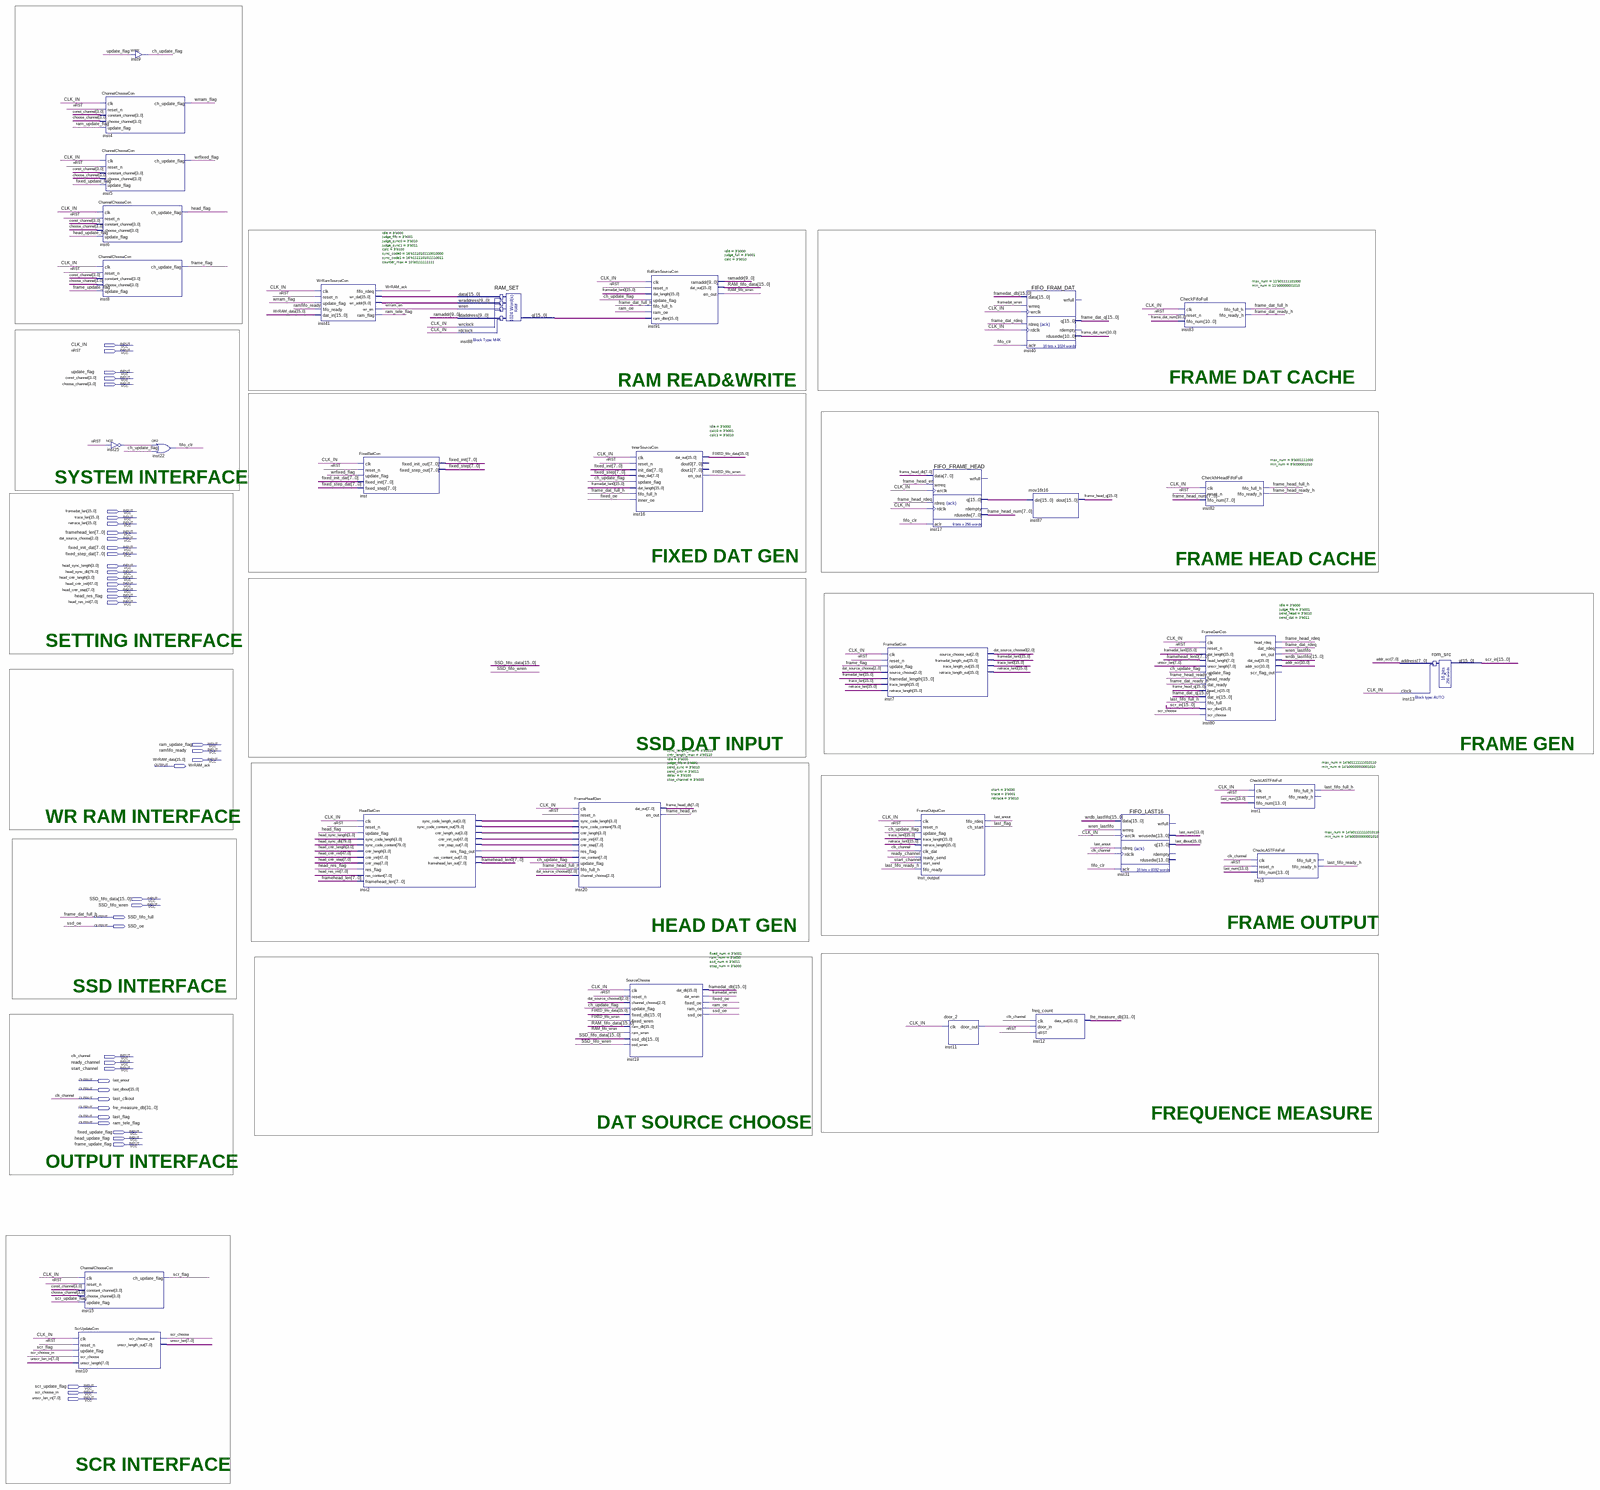
[diagram p0: schematic sheet, whole]
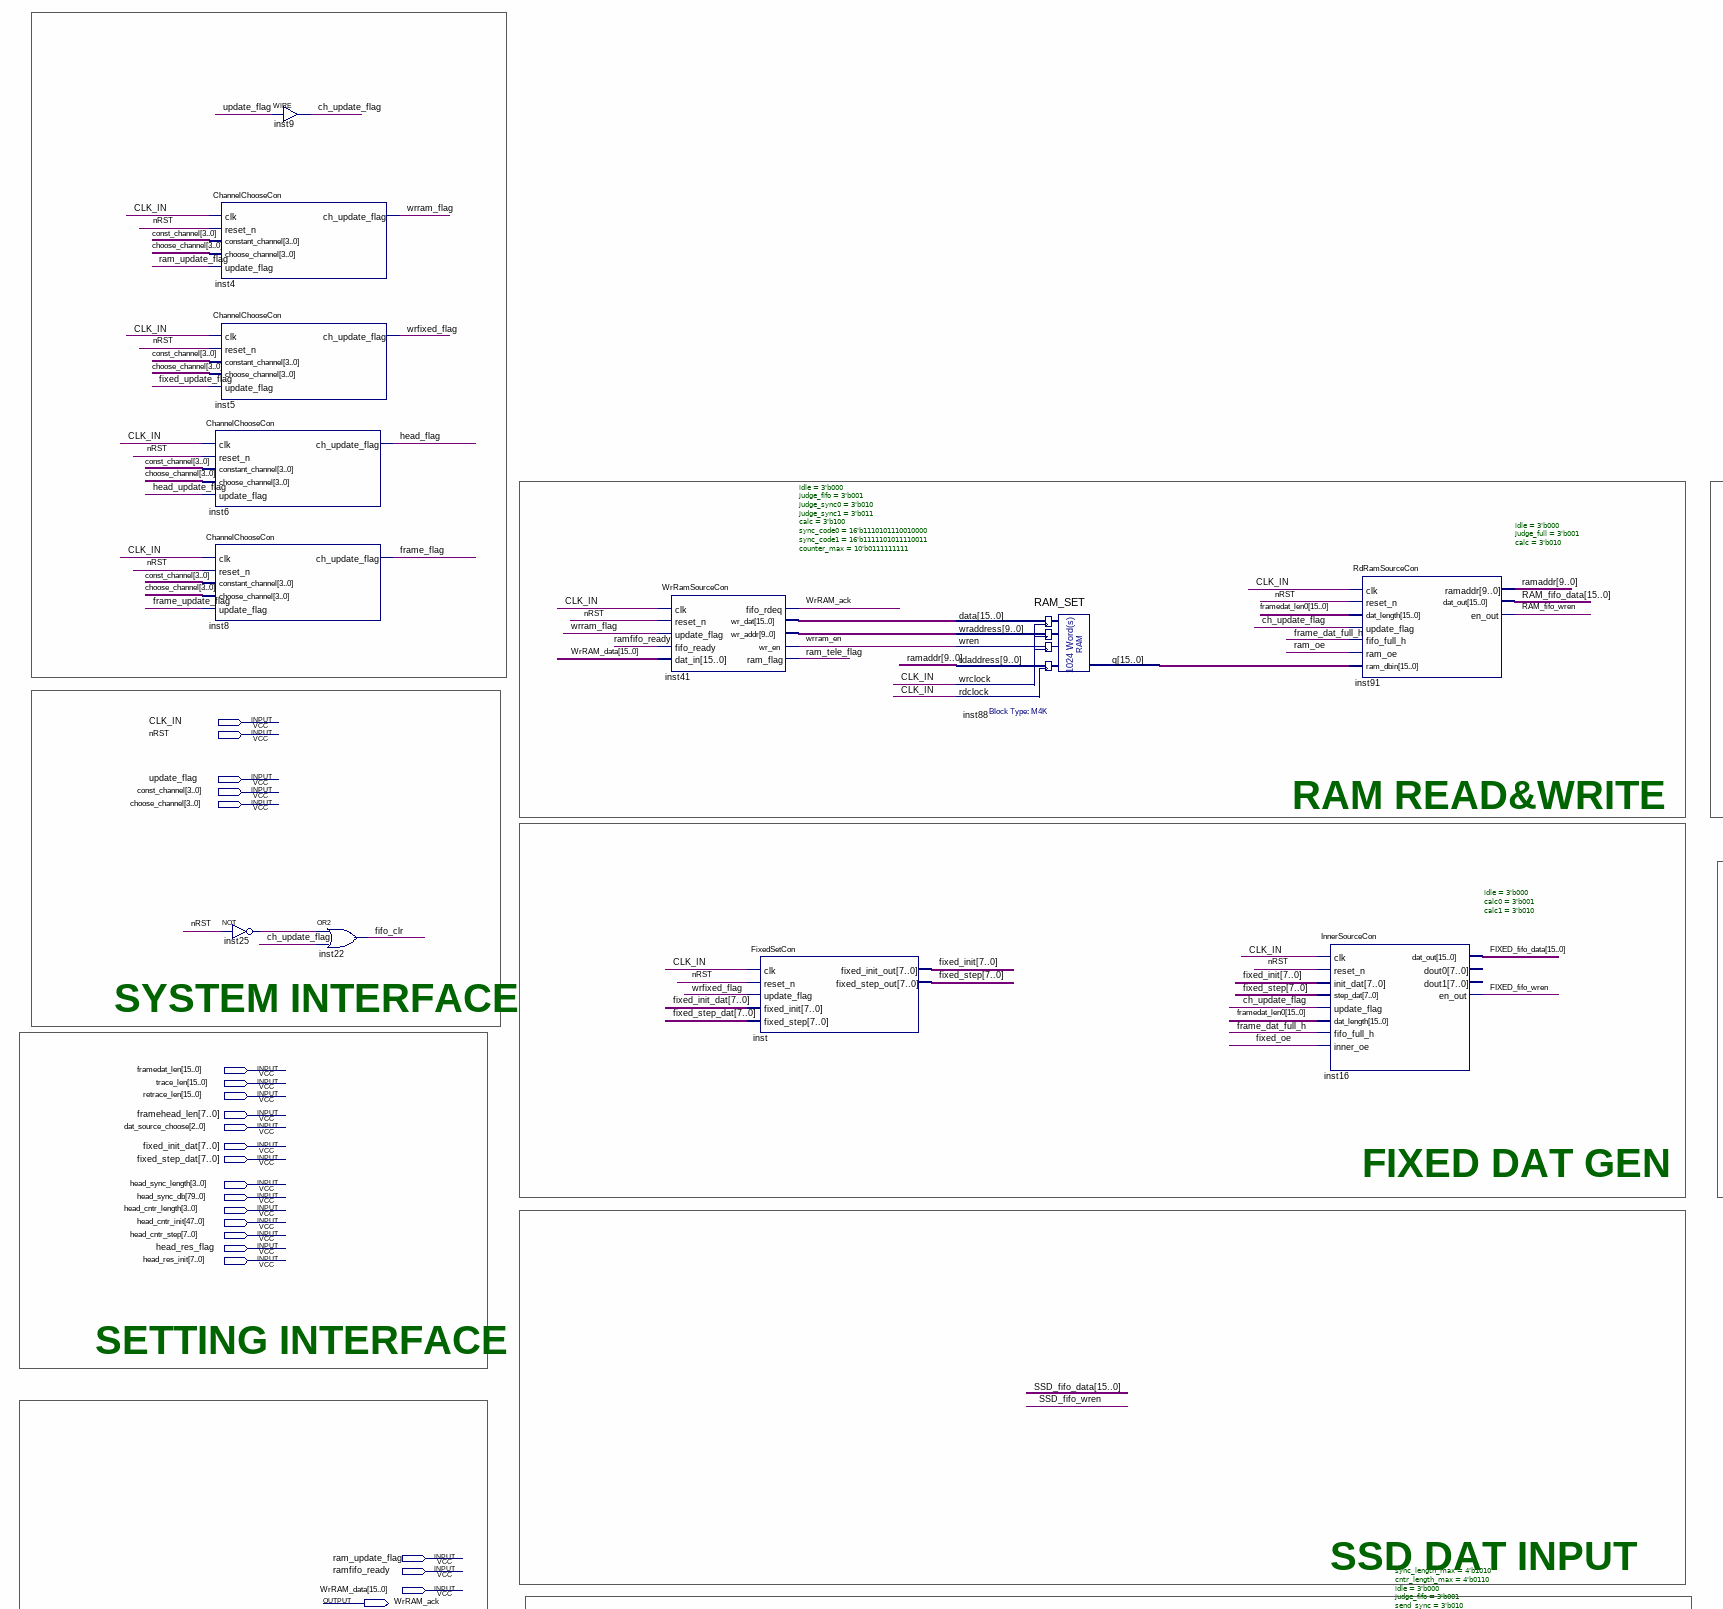
[diagram p1: schematic sheet, upper left part]
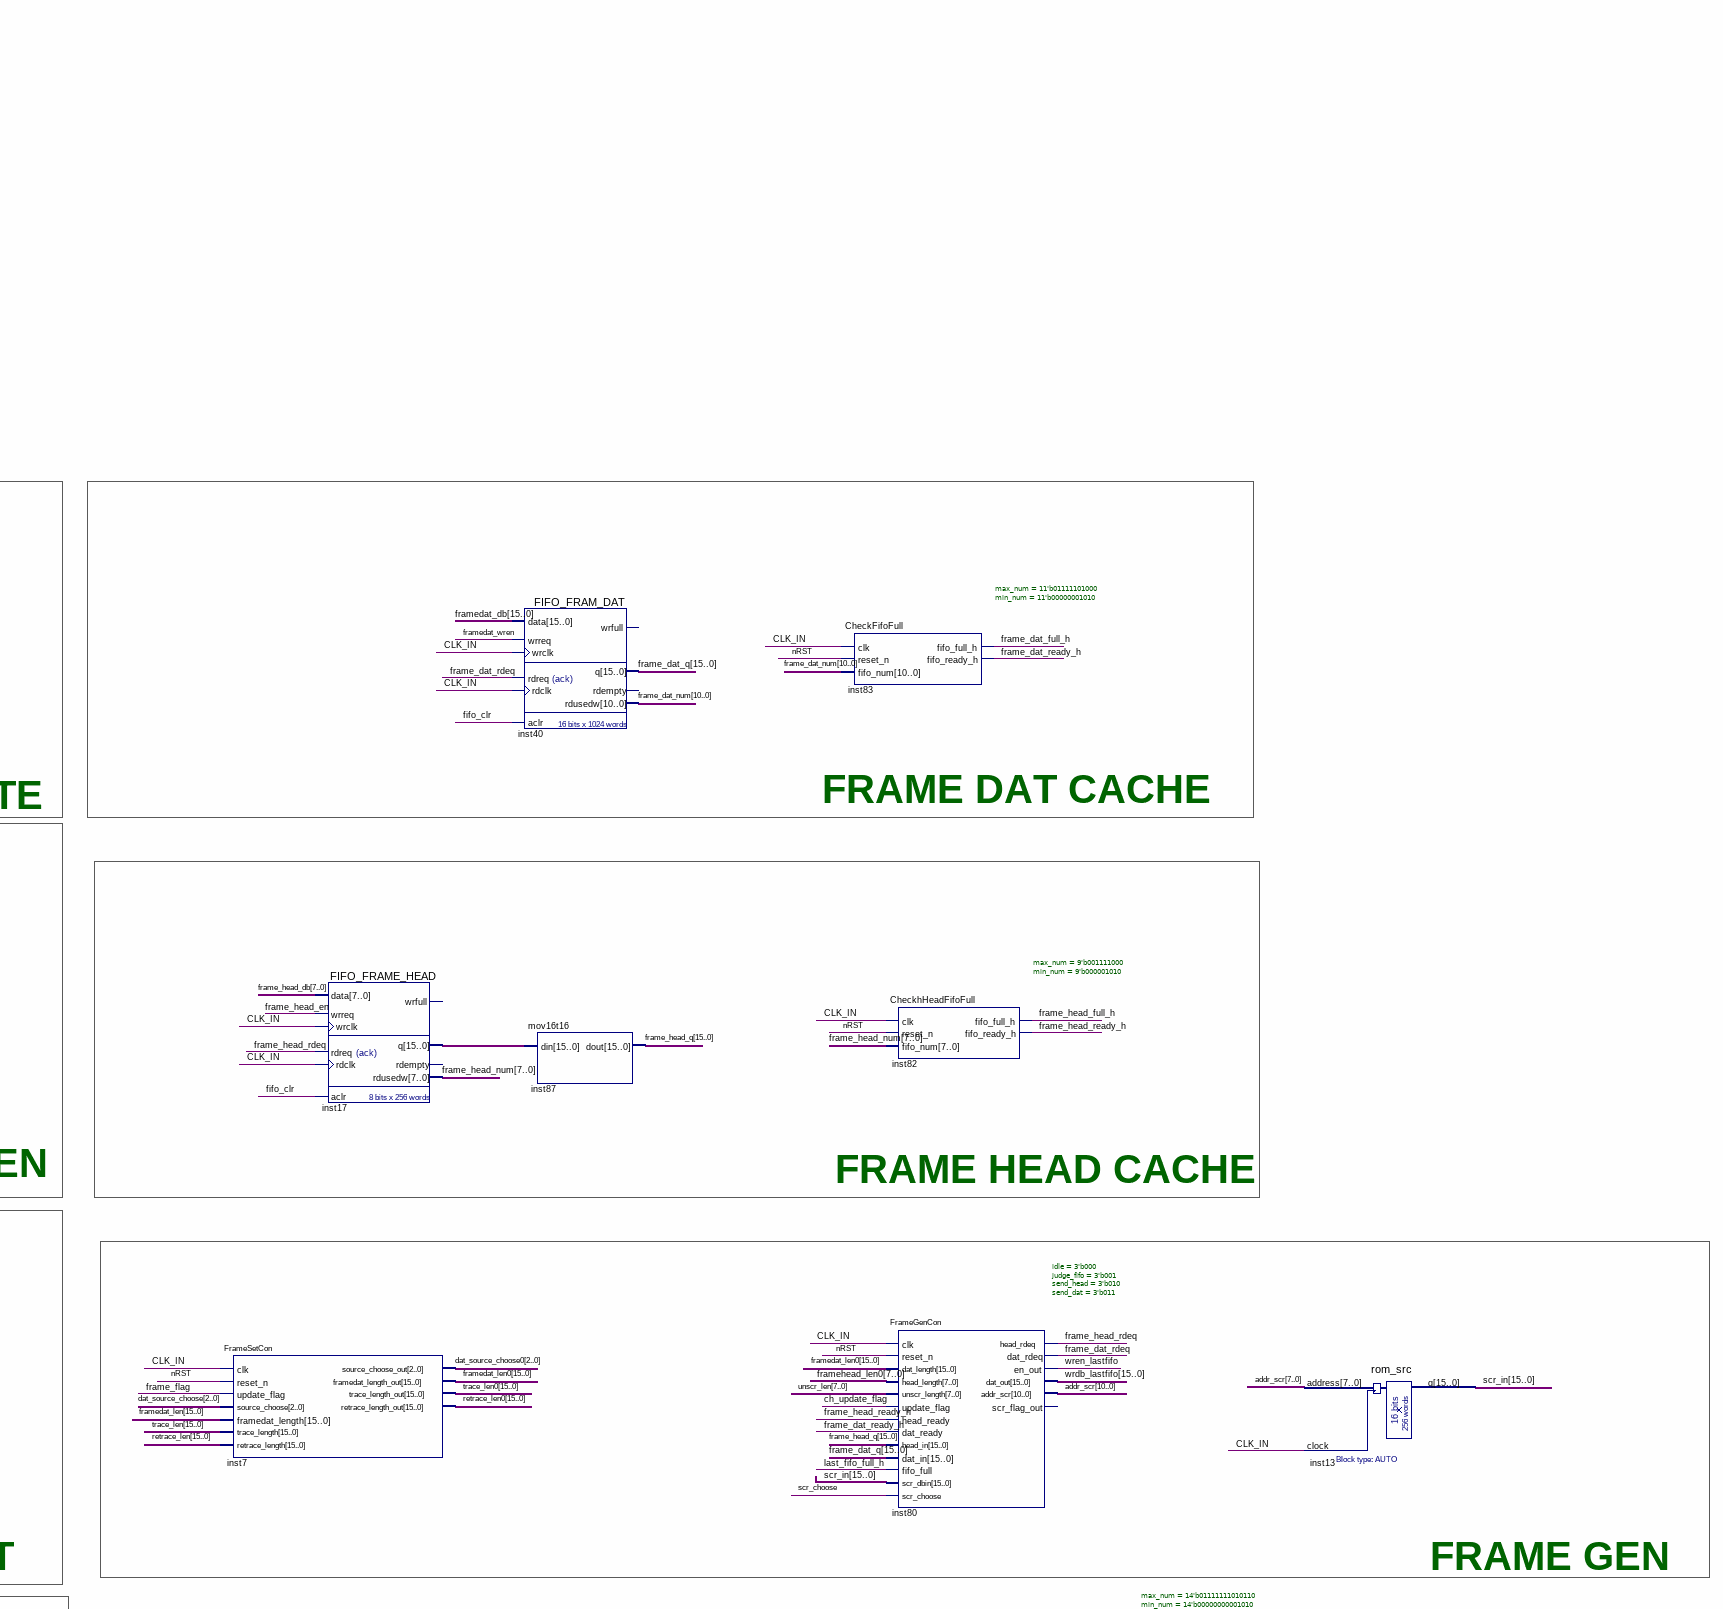
[diagram p2: schematic sheet, upper right part]
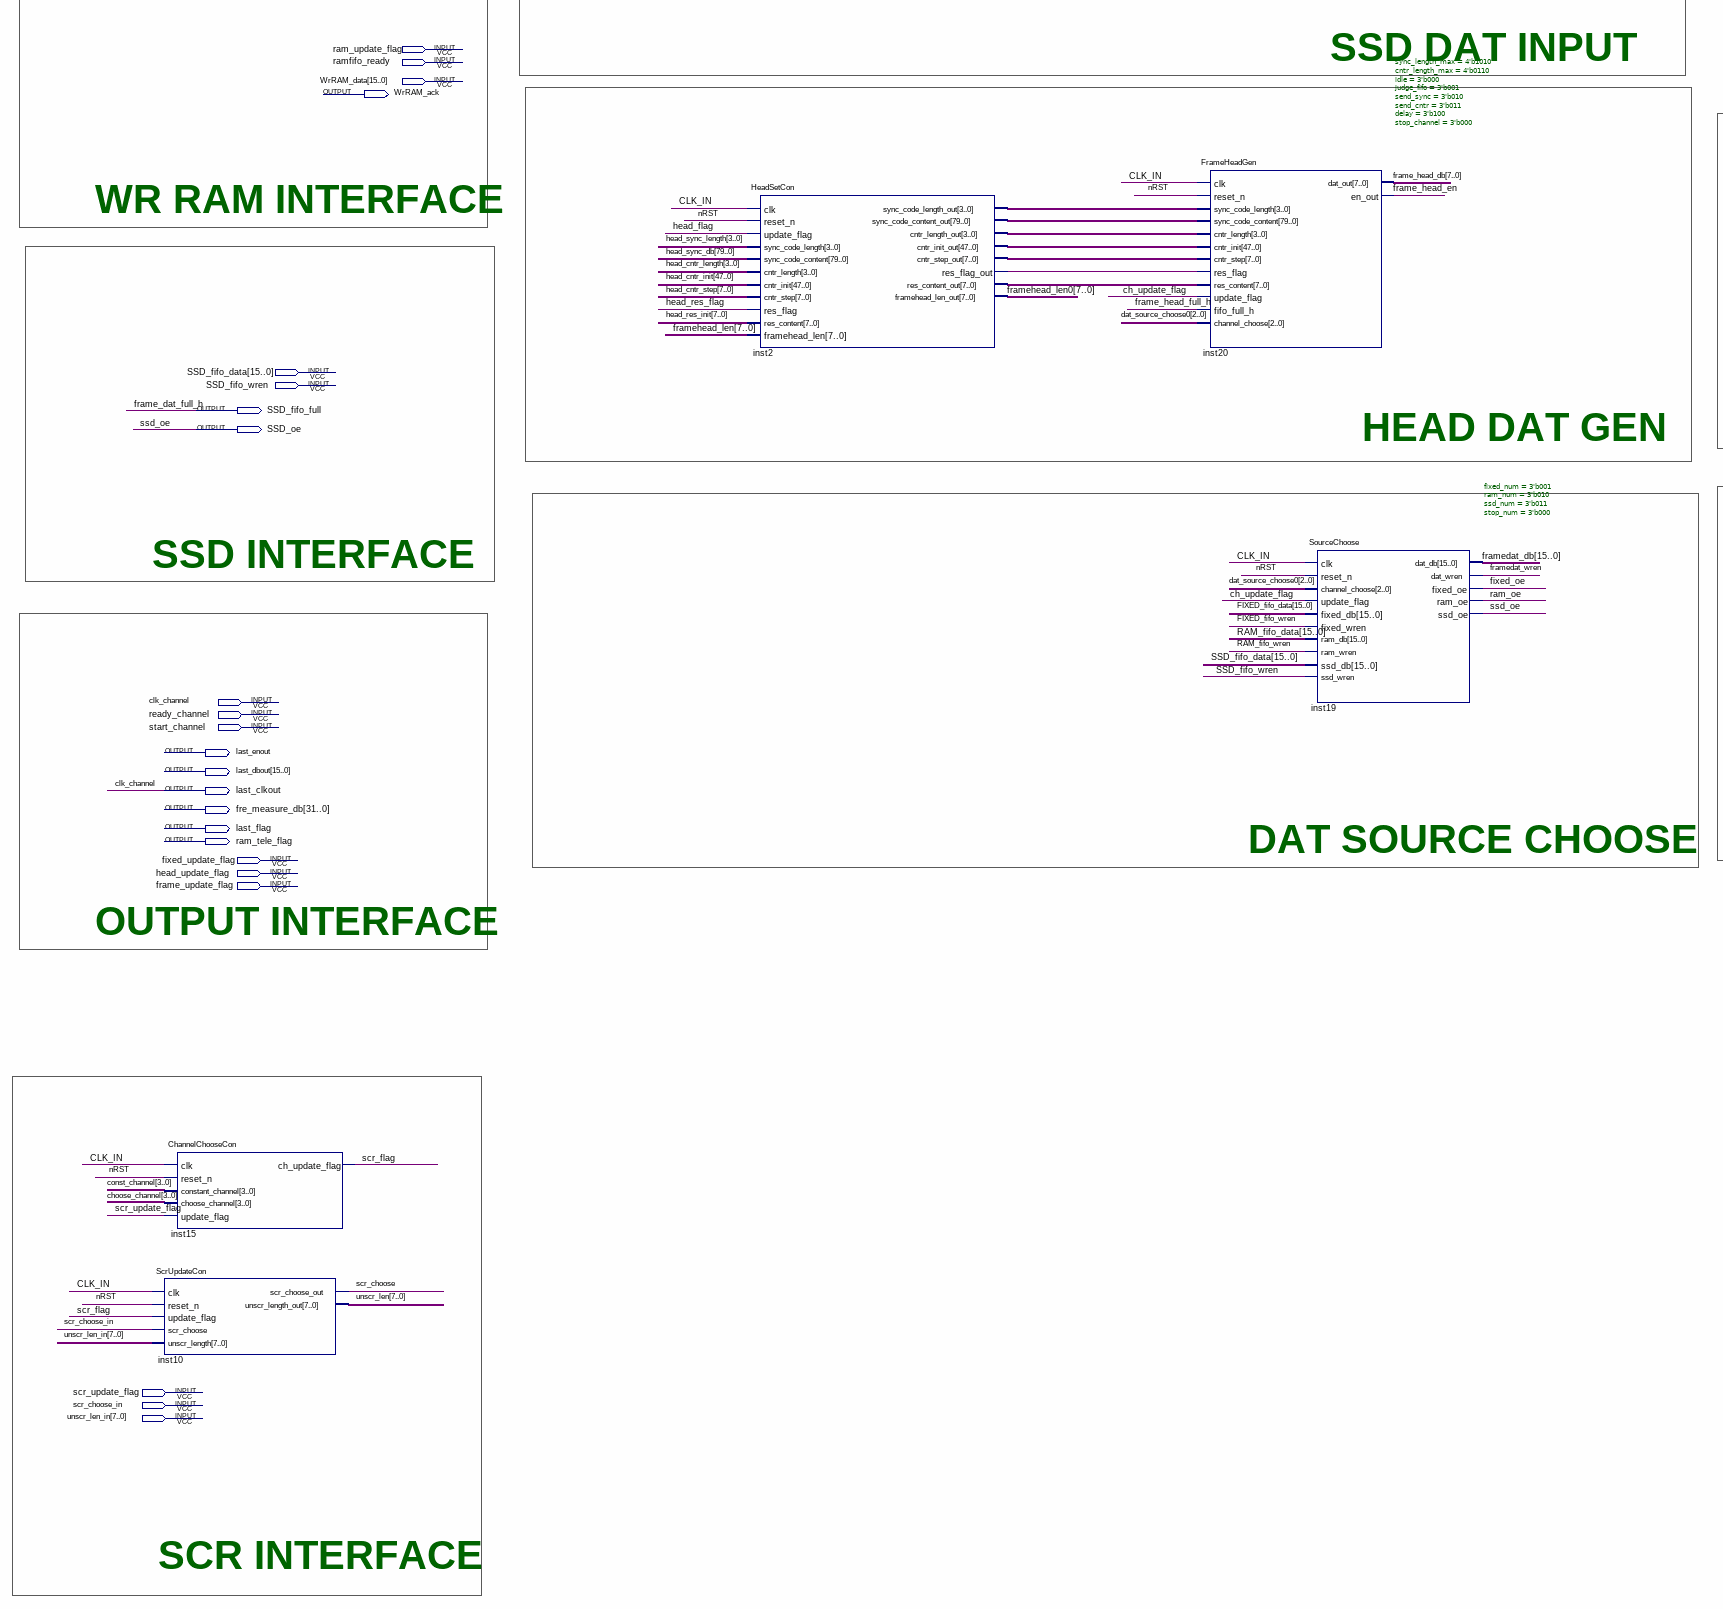
[diagram p3: schematic sheet, lower left part]
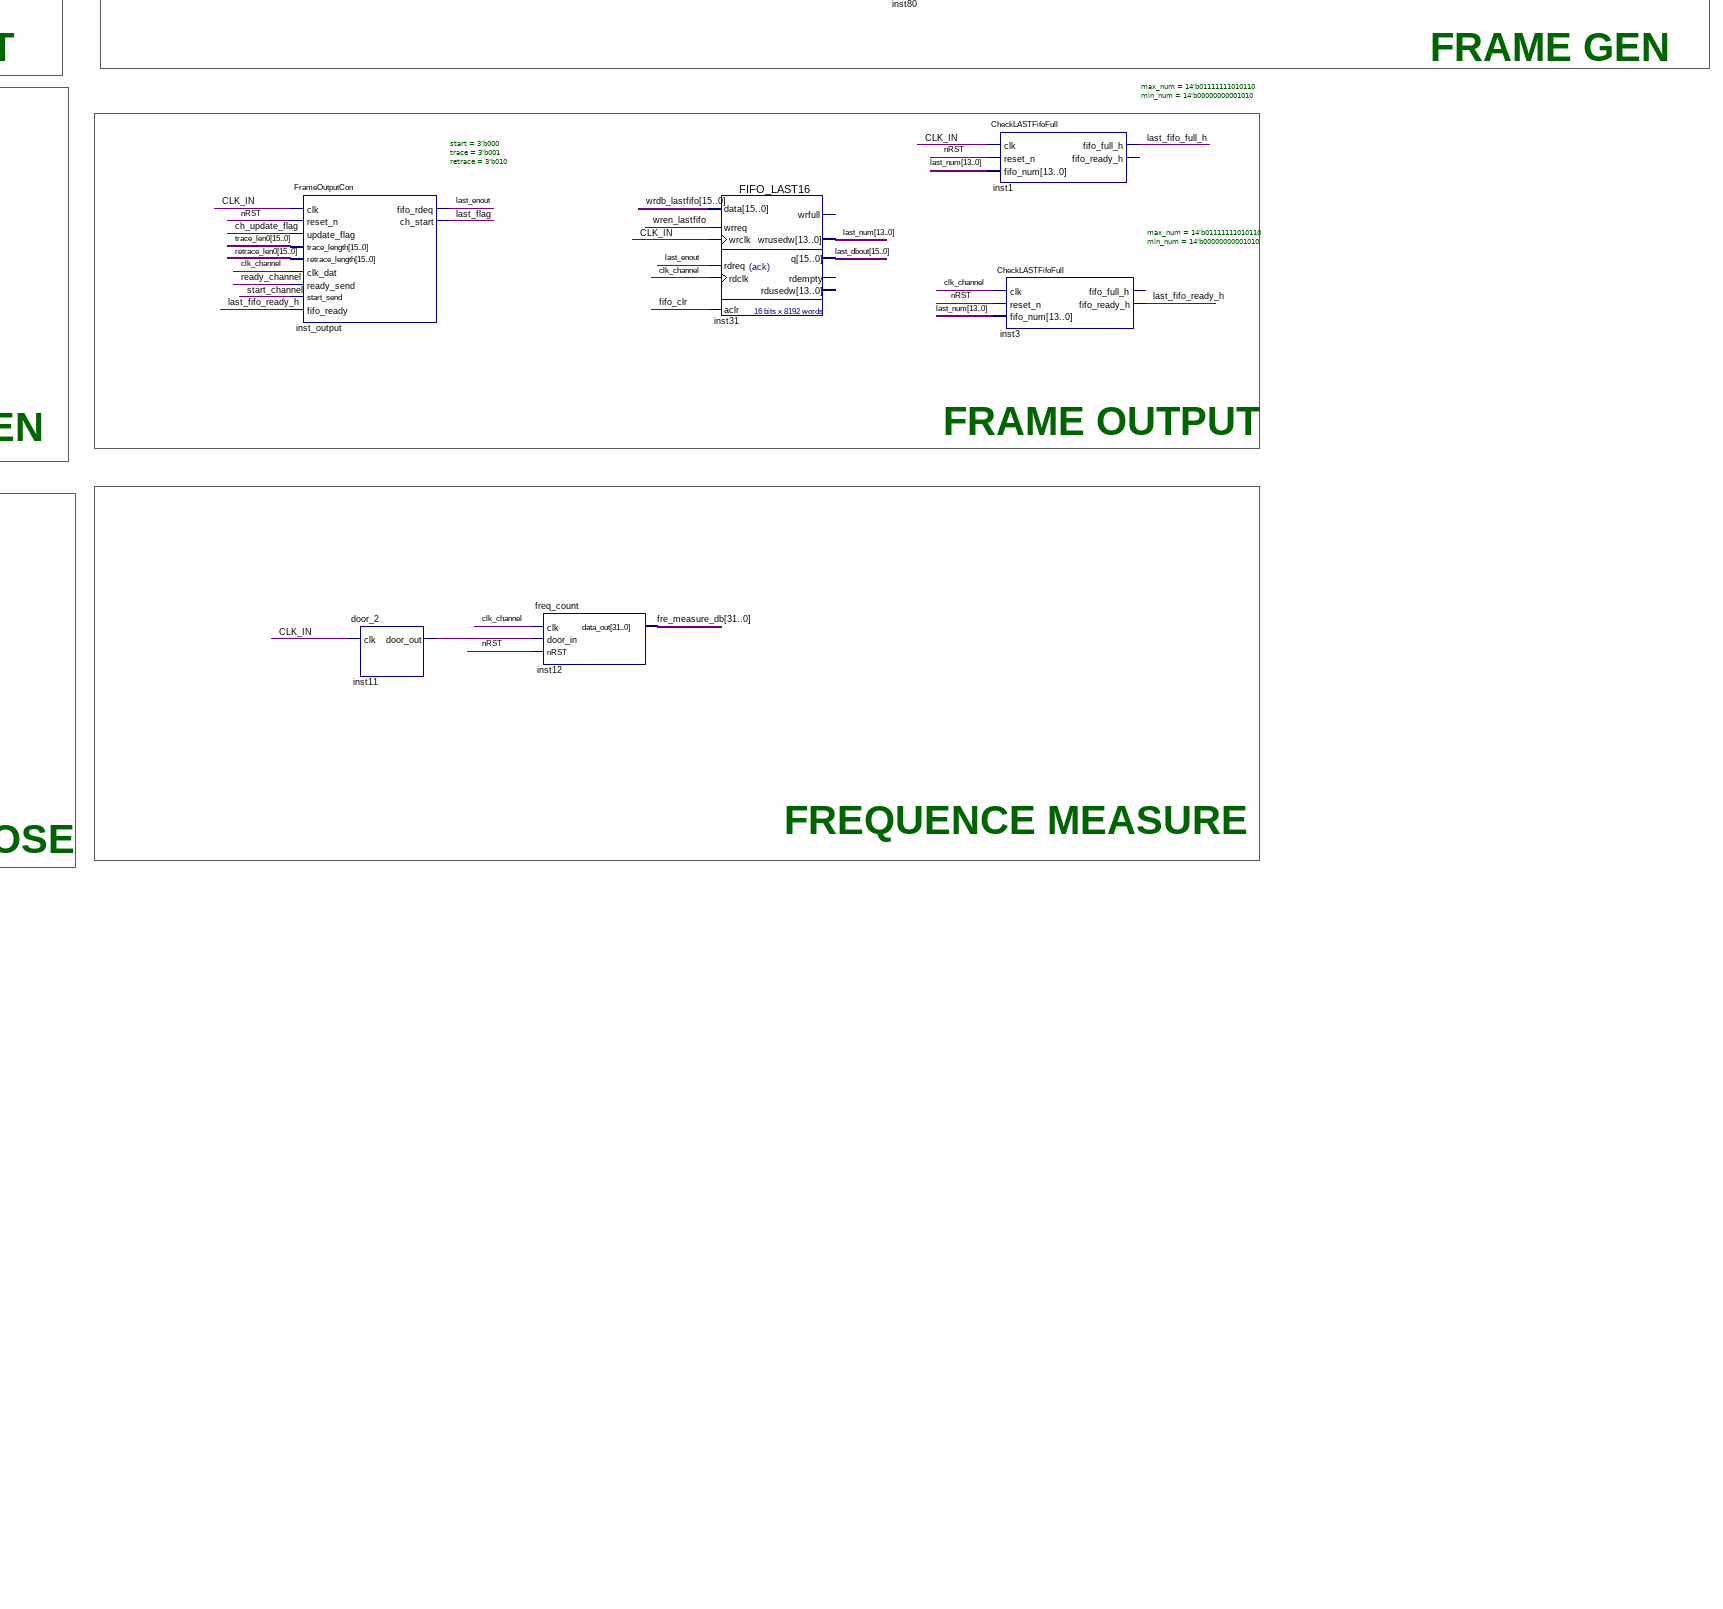
[diagram p4: schematic sheet, lower right part]
// Quartus schematic CHANNEL_CON.bdf as structural Verilog: 31 symbols, 42 pins
module CHANNEL_CON (
  input  CLK_IN,
  input  nRST,
  input  update_flag,
  input  [3:0] const_channel,
  input  [3:0] choose_channel,
  input  [15:0] framedat_len,
  input  [15:0] trace_len,
  input  [15:0] retrace_len,
  input  [7:0] framehead_len,
  input  [2:0] dat_source_choose,
  input  [7:0] fixed_init_dat,
  input  [7:0] fixed_step_dat,
  input  [3:0] head_sync_length,
  input  [79:0] head_sync_db,
  input  [3:0] head_cntr_length,
  input  [47:0] head_cntr_init,
  input  [7:0] head_cntr_step,
  input  head_res_flag,
  input  [7:0] head_res_init,
  input  ram_update_flag,
  input  ramfifo_ready,
  input  [15:0] WrRAM_data,
  input  [15:0] SSD_fifo_data,
  input  SSD_fifo_wren,
  input  clk_channel,
  input  ready_channel,
  input  start_channel,
  input  fixed_update_flag,
  input  head_update_flag,
  input  frame_update_flag,
  input  scr_update_flag,
  input  scr_choose_in,
  input  [7:0] unscr_len_in,
  output WrRAM_ack,
  output SSD_fifo_full,
  output SSD_oe,
  output last_enout,
  output [15:0] last_dbout,
  output last_clkout,
  output [31:0] fre_measure_db,
  output last_flag,
  output ram_tele_flag
);

  wire ch_update_flag, fifo_clr, FIXED_fifo_wren, fixed_oe, frame_dat_rdeq, frame_dat_ready_h, frame_flag,
       frame_head_en, frame_head_full_h, frame_head_rdeq, frame_head_ready_h, framedat_wren, head_flag,
       inst2_res_flag_out, inst11_door_out, inst25_out, last_fifo_full_h, last_fifo_ready_h, RAM_fifo_wren,
       ram_oe, scr_choose, scr_flag, wren_lastfifo, wrfixed_flag, wrram_en, wrram_flag;
  wire [2:0] dat_source_choose0;
  wire [3:0] inst2_cntr_length_out, inst2_sync_code_length_out;
  wire [7:0] fixed_init, fixed_step, frame_head_db, frame_head_num, framehead_len0, inst2_cntr_step_out,
       inst2_res_content_out, unscr_len;
  wire [9:0] inst41_wr_addr, ramaddr;
  wire [10:0] addr_scr, frame_dat_num;
  wire [13:0] last_num;
  wire [15:0] FIXED_fifo_data, frame_dat_q, frame_head_q, framedat_db, framedat_len0, inst17_q,
       inst41_wr_dat, inst88_q, RAM_fifo_data, retrace_len0, scr_in, trace_len0, wrdb_lastfifo;
  wire [47:0] inst2_cntr_init_out;
  wire [79:0] inst2_sync_code_content_out;

  ScrUpdateCon inst10 (
    .clk(CLK_IN), .reset_n(nRST), .update_flag(scr_flag), .scr_choose(scr_choose_in),
    .unscr_length(unscr_len_in), .scr_choose_out(scr_choose), .unscr_length_out(unscr_len));
  ChannelChooseCon inst4 (
    .clk(CLK_IN), .reset_n(nRST), .constant_channel(const_channel), .choose_channel(choose_channel),
    .update_flag(ram_update_flag), .ch_update_flag(wrram_flag));
  ChannelChooseCon inst5 (
    .clk(CLK_IN), .reset_n(nRST), .constant_channel(const_channel), .choose_channel(choose_channel),
    .update_flag(fixed_update_flag), .ch_update_flag(wrfixed_flag));
  ChannelChooseCon inst6 (
    .clk(CLK_IN), .reset_n(nRST), .constant_channel(const_channel), .choose_channel(choose_channel),
    .update_flag(head_update_flag), .ch_update_flag(head_flag));
  ChannelChooseCon inst8 (
    .clk(CLK_IN), .reset_n(nRST), .constant_channel(const_channel), .choose_channel(choose_channel),
    .update_flag(frame_update_flag), .ch_update_flag(frame_flag));
  ChannelChooseCon inst15 (
    .clk(CLK_IN), .reset_n(nRST), .constant_channel(const_channel), .choose_channel(choose_channel),
    .update_flag(scr_update_flag), .ch_update_flag(scr_flag));
  not inst25 (inst25_out, nRST);
  assign ch_update_flag = update_flag;  // WIRE inst9
  or inst22 (fifo_clr, inst25_out, ch_update_flag);
  WrRamSourceCon #(.idle(3'b000), .judge_fifo(3'b001), .judge_sync0(3'b010), .judge_sync1(3'b011), .calc(3'b100), .sync_code0(16'b1110101110010000), .sync_code1(16'b1111101011110011), .counter_max(10'b0111111111)) inst41 (
    .clk(CLK_IN), .reset_n(nRST), .update_flag(wrram_flag), .fifo_ready(ramfifo_ready), .dat_in(WrRAM_data),
    .fifo_rdeq(WrRAM_ack), .wr_dat(inst41_wr_dat), .wr_addr(inst41_wr_addr), .wr_en(wrram_en),
    .ram_flag(ram_tele_flag));
  FixedSetCon inst (
    .clk(CLK_IN), .reset_n(nRST), .update_flag(wrfixed_flag), .fixed_init(fixed_init_dat),
    .fixed_step(fixed_step_dat), .fixed_init_out(fixed_init), .fixed_step_out(fixed_step));
  HeadSetCon inst2 (
    .clk(CLK_IN), .reset_n(nRST), .update_flag(head_flag), .sync_code_length(head_sync_length),
    .sync_code_content(head_sync_db), .cntr_length(head_cntr_length), .cntr_init(head_cntr_init),
    .cntr_step(head_cntr_step), .res_flag(head_res_flag), .res_content(head_res_init),
    .framehead_len(framehead_len), .sync_code_length_out(inst2_sync_code_length_out),
    .sync_code_content_out(inst2_sync_code_content_out), .cntr_length_out(inst2_cntr_length_out),
    .cntr_init_out(inst2_cntr_init_out), .cntr_step_out(inst2_cntr_step_out),
    .res_flag_out(inst2_res_flag_out), .res_content_out(inst2_res_content_out),
    .framehead_len_out(framehead_len0));
  RAM_SET inst88 (
    .data(inst41_wr_dat), .wraddress(inst41_wr_addr), .wren(wrram_en), .rdaddress(ramaddr), .wrclock(CLK_IN),
    .rdclock(CLK_IN), .q(inst88_q));
  FrameHeadGen #(.sync_length_max(4'b1010), .cntr_length_max(4'b0110), .idle(3'b000), .judge_fifo(3'b001), .send_sync(3'b010), .send_cntr(3'b011), .delay(3'b100), .stop_channel(3'b000)) inst20 (
    .clk(CLK_IN), .reset_n(nRST), .sync_code_length(inst2_sync_code_length_out),
    .sync_code_content(inst2_sync_code_content_out), .cntr_length(inst2_cntr_length_out),
    .cntr_init(inst2_cntr_init_out), .cntr_step(inst2_cntr_step_out), .res_flag(inst2_res_flag_out),
    .res_content(inst2_res_content_out), .update_flag(ch_update_flag), .fifo_full_h(frame_head_full_h),
    .channel_choose(dat_source_choose0), .dat_out(frame_head_db), .en_out(frame_head_en));
  InnerSourceCon #(.idle(3'b000), .calc0(3'b001), .calc1(3'b010)) inst16 (
    .clk(CLK_IN), .reset_n(nRST), .init_dat(fixed_init), .step_dat(fixed_step), .update_flag(ch_update_flag),
    .dat_length(framedat_len0), .fifo_full_h(SSD_fifo_full), .inner_oe(fixed_oe), .dat_out(FIXED_fifo_data),
    .en_out(FIXED_fifo_wren));  // open: dout0, dout1
  SourceChoose #(.fixed_num(3'b001), .ram_num(3'b010), .ssd_num(3'b011), .stop_num(3'b000)) inst19 (
    .clk(CLK_IN), .reset_n(nRST), .channel_choose(dat_source_choose0), .update_flag(ch_update_flag),
    .fixed_db(FIXED_fifo_data), .fixed_wren(FIXED_fifo_wren), .ram_db(RAM_fifo_data),
    .ram_wren(RAM_fifo_wren), .ssd_db(SSD_fifo_data), .ssd_wren(SSD_fifo_wren), .dat_db(framedat_db),
    .dat_wren(framedat_wren), .fixed_oe(fixed_oe), .ram_oe(ram_oe), .ssd_oe(SSD_oe));
  RdRamSourceCon #(.idle(3'b000), .judge_full(3'b001), .calc(3'b010)) inst91 (
    .clk(CLK_IN), .reset_n(nRST), .dat_length(framedat_len0), .update_flag(ch_update_flag),
    .fifo_full_h(SSD_fifo_full), .ram_oe(ram_oe), .ram_dbin(inst88_q), .ramaddr(ramaddr),
    .dat_out(RAM_fifo_data), .en_out(RAM_fifo_wren));
  FrameSetCon inst7 (
    .clk(CLK_IN), .reset_n(nRST), .update_flag(frame_flag), .source_choose(dat_source_choose),
    .framedat_length(framedat_len), .trace_length(trace_len), .retrace_length(retrace_len),
    .source_choose_out(dat_source_choose0), .framedat_length_out(framedat_len0),
    .trace_length_out(trace_len0), .retrace_length_out(retrace_len0));
  FrameOutputCon #(.start(3'b000), .trace(3'b001), .retrace(3'b010)) inst_output (
    .clk(CLK_IN), .reset_n(nRST), .update_flag(ch_update_flag), .trace_length(trace_len0),
    .retrace_length(retrace_len0), .clk_dat(clk_channel), .ready_send(ready_channel),
    .start_send(start_channel), .fifo_ready(last_fifo_ready_h), .fifo_rdeq(last_enout), .ch_start(last_flag));
  FIFO_FRAME_HEAD inst17 (
    .data(frame_head_db), .wrreq(frame_head_en), .wrclk(CLK_IN), .rdreq(frame_head_rdeq), .rdclk(CLK_IN),
    .aclr(fifo_clr), .q(inst17_q), .rdusedw(frame_head_num));  // open: wrfull, rdempty
  door_2 inst11 (.clk(CLK_IN), .door_out(inst11_door_out));
  FIFO_FRAM_DAT inst40 (
    .data(framedat_db), .wrreq(framedat_wren), .wrclk(CLK_IN), .rdreq(frame_dat_rdeq), .rdclk(CLK_IN),
    .aclr(fifo_clr), .q(frame_dat_q), .rdusedw(frame_dat_num));  // open: wrfull, rdempty
  mov16t16 inst87 (.din(inst17_q), .dout(frame_head_q));
  freq_count inst12 (.clk(clk_channel), .door_in(inst11_door_out), .nRST(nRST), .data_out(fre_measure_db));
  FIFO_LAST16 inst31 (
    .data(wrdb_lastfifo), .wrreq(wren_lastfifo), .wrclk(CLK_IN), .rdreq(last_enout), .rdclk(clk_channel),
    .aclr(fifo_clr), .wrusedw(last_num), .q(last_dbout));  // open: wrfull, rdempty, rdusedw
  CheckFifoFull #(.max_num(11'b01111101000), .min_num(11'b00000001010)) inst83 (
    .clk(CLK_IN), .reset_n(nRST), .fifo_num(frame_dat_num), .fifo_full_h(SSD_fifo_full),
    .fifo_ready_h(frame_dat_ready_h));
  CheckhHeadFifoFull #(.max_num(9'b001111000), .min_num(9'b000001010)) inst82 (
    .clk(CLK_IN), .reset_n(nRST), .fifo_num(frame_head_num), .fifo_full_h(frame_head_full_h),
    .fifo_ready_h(frame_head_ready_h));
  FrameGenCon #(.idle(3'b000), .judge_fifo(3'b001), .send_head(3'b010), .send_dat(3'b011)) inst80 (
    .clk(CLK_IN), .reset_n(nRST), .dat_length(framedat_len0), .head_length(framehead_len0),
    .unscr_length(unscr_len), .update_flag(ch_update_flag), .head_ready(frame_head_ready_h),
    .dat_ready(frame_dat_ready_h), .head_in(frame_head_q), .dat_in(frame_dat_q),
    .fifo_full(last_fifo_full_h), .scr_dbin(scr_in), .scr_choose(scr_choose), .head_rdeq(frame_head_rdeq),
    .dat_rdeq(frame_dat_rdeq), .en_out(wren_lastfifo), .dat_out(wrdb_lastfifo), .addr_scr(addr_scr));  // open: scr_flag_out
  CheckLASTFifoFull #(.max_num(14'b01111111010110), .min_num(14'b00000000001010)) inst1 (
    .clk(CLK_IN), .reset_n(nRST), .fifo_num(last_num), .fifo_full_h(last_fifo_full_h));  // open: fifo_ready_h
  CheckLASTFifoFull #(.max_num(14'b01111111010110), .min_num(14'b00000000001010)) inst3 (
    .clk(clk_channel), .reset_n(nRST), .fifo_num(last_num), .fifo_ready_h(last_fifo_ready_h));  // open: fifo_full_h
  rom_src inst13 (.address(addr_scr[7:0]), .clock(CLK_IN), .q(scr_in));

  assign last_clkout = clk_channel;

  // Other names for the same wires on the sheet: frame_dat_full_h = SSD_fifo_full

  // Notes on the sheet:
  //   FRAME DAT CACHE
  //   RAM READ&WRITE
  //   SYSTEM INTERFACE
  //   FIXED DAT GEN
  //   FRAME HEAD CACHE
  //   SETTING INTERFACE
  //   SSD DAT INPUT
  //   FRAME GEN
  //   WR RAM INTERFACE
  //   FRAME OUTPUT
  //   HEAD DAT GEN
  //   SSD INTERFACE
  //   FREQUENCE MEASURE
  //   DAT SOURCE CHOOSE
  //   OUTPUT INTERFACE
  //   SCR INTERFACE
endmodule
